# EAGLE design XmasTree (EAGLE 9.6.2)
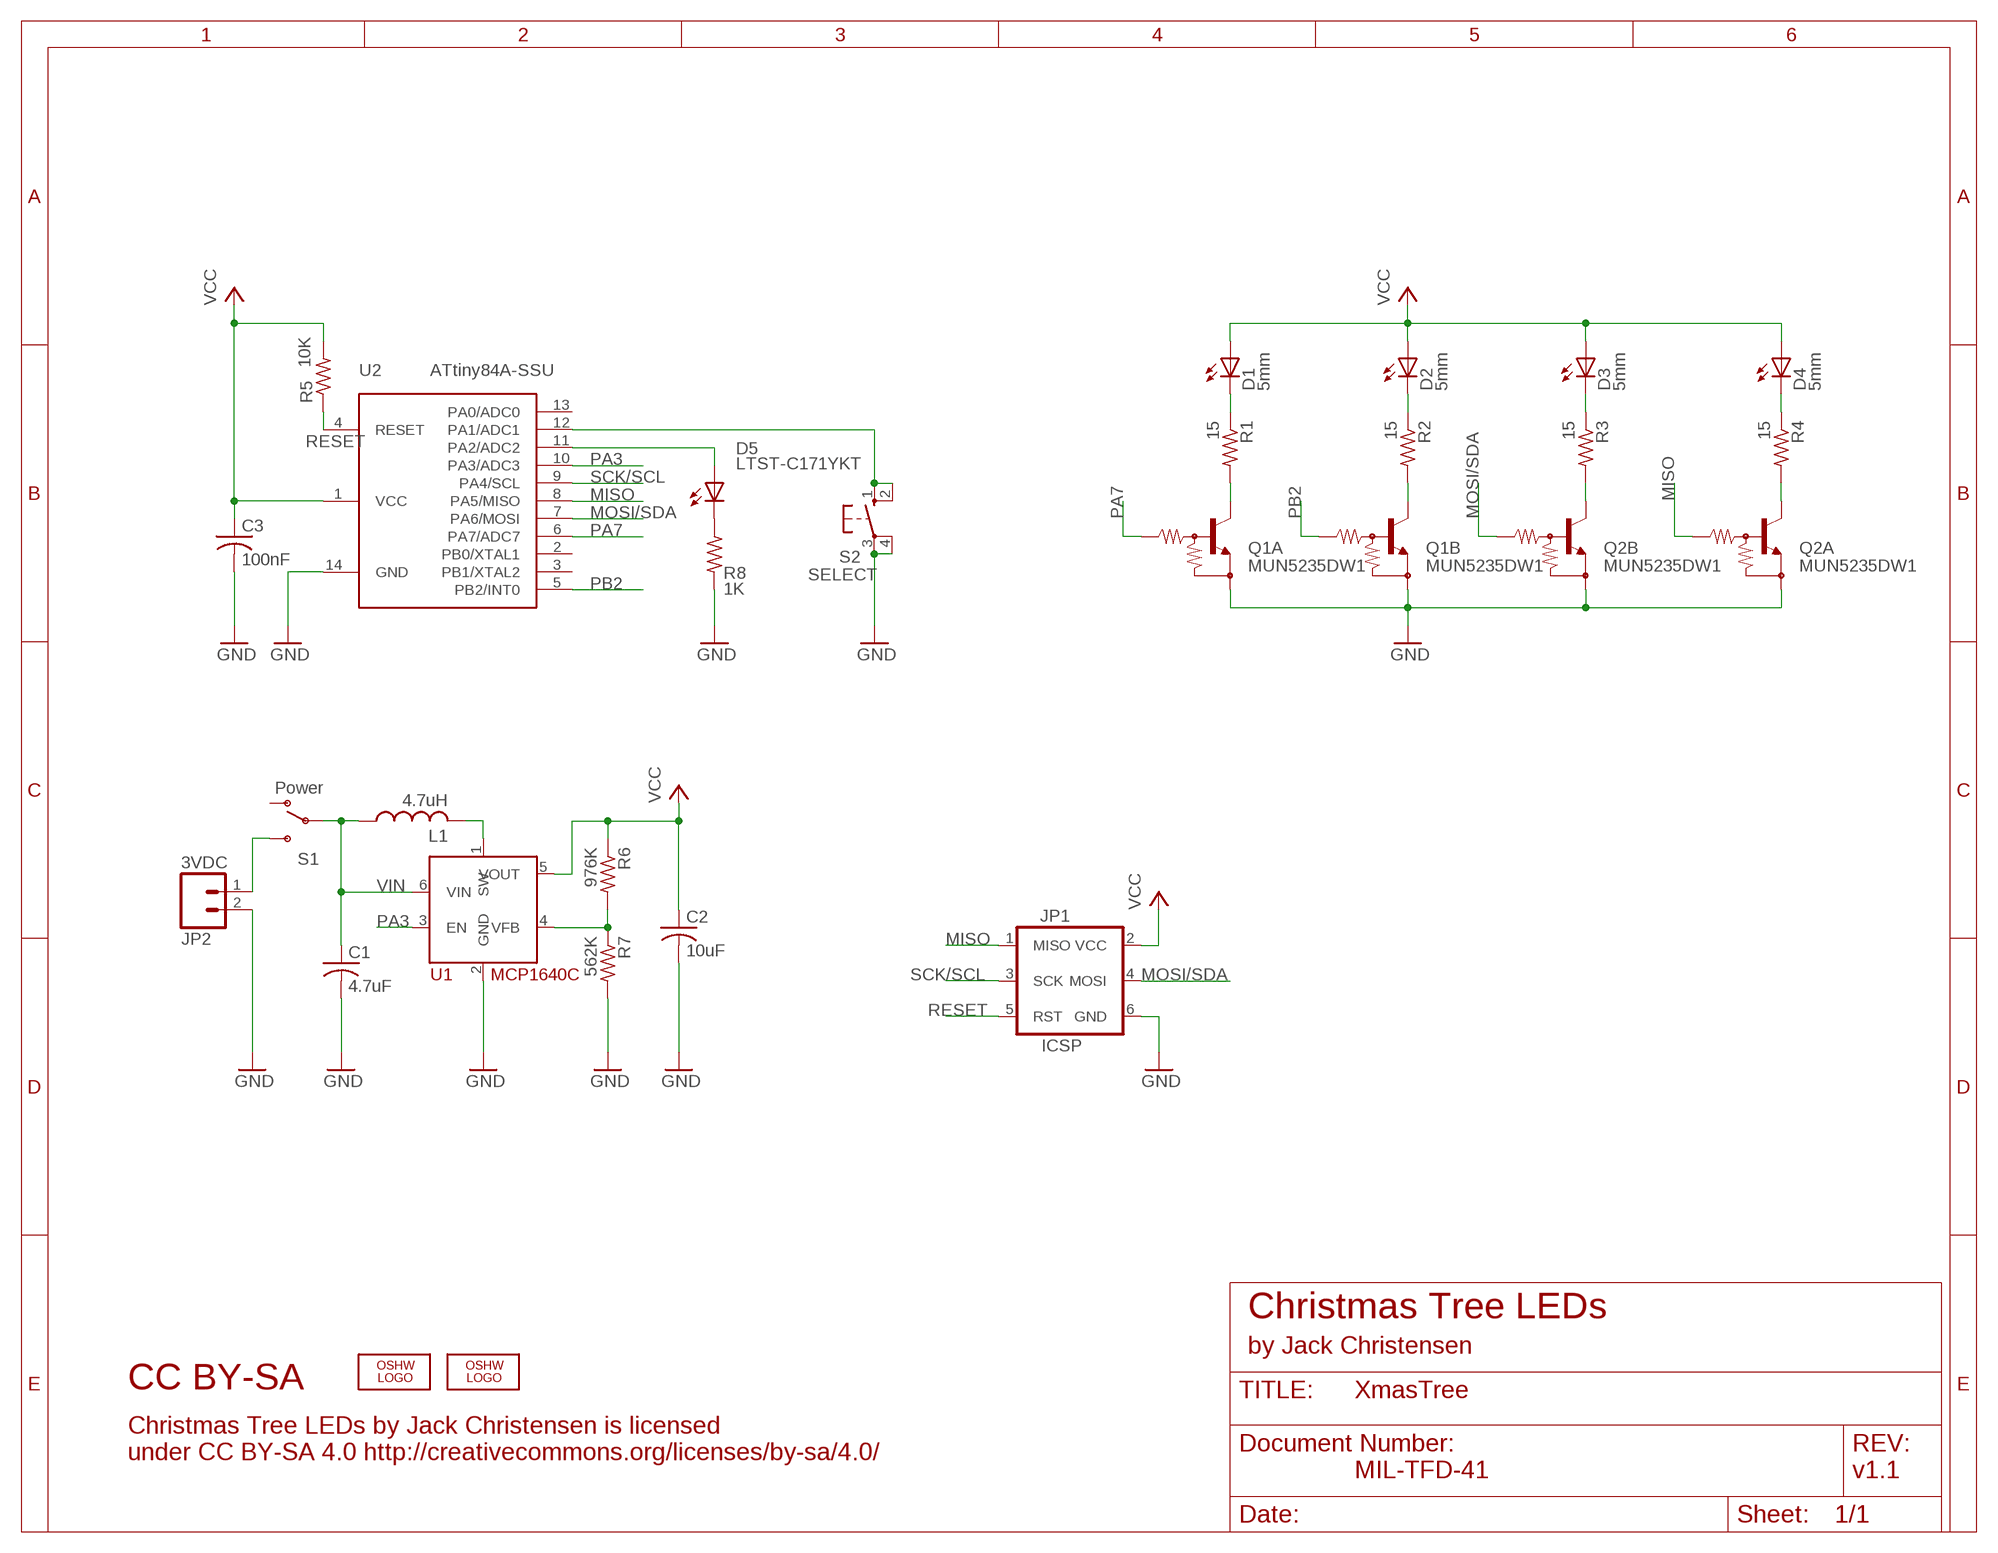
[diagram p0: schematic, sheet 1]

## Parts
C1  4.7uF  C-USM0805  [M0805]
C2  10uF  C-USM0805  [M0805]
C3  100nF  C-USM0805  [M0805]
D1  5mm  LED5MM  [LED5MM]
D2  5mm  LED5MM  [LED5MM]
D3  5mm  LED5MM  [LED5MM]
D4  5mm  LED5MM  [LED5MM]
D5  LTST-C171YKT  LEDD0805  [D0805]
JP1  ICSP  AVR_SPI_PRG_62X3_LOCK  [2X3_LOCK]
JP2  3VDC  M02  [1X02_LONGPADS]
L1  4.7uH  INDUCTORC1210K  [C1210K]
LOGO1  OSHW_LOGO_8MILX0150-NT  [OSHW_8X150_NOTEXT]
LOGO2  OSHW_LOGO_8MILX0150-NT  [OSHW_8X150_NOTEXT]
Q1  MUN5235DW1  MUN52XXSOT363  [SOT363_PHILIPS]
Q2  MUN5235DW1  MUN52XXSOT363  [SOT363_PHILIPS]
R1  15  R-US_M0805  [M0805]
R2  15  R-US_M0805  [M0805]
R3  15  R-US_M0805  [M0805]
R4  15  R-US_M0805  [M0805]
R5  10K  R-US_M0805  [M0805]
R6  976K  R-US_M0805  [M0805]
R7  562K  R-US_M0805  [M0805]
R8  1K  R-US_M0805  [M0805]
S1  Power  SWITCH-SPST  [JS102011CQN]
S2  SELECT  10-XXOCT  [B3F-10XXOCT]
U1  MCP1640C  MCP1640  [SOT23-6]
U2  ATtiny84A-SSU  ATTINYX4SO14  [SO14]

## Nets
GND: C1.2 C2.2 C3.2 JP1.6(GND) JP2.2 Q1.1(B:E) Q1.4(A:E) Q2.1(B:E) Q2.4(A:E) R7.2 R8.2 S2.3(P) S2.4(P1) U1.2(GND) U2.14(GND)
MISO: JP1.1(MISO) Q2.5(A:B) U2.8(PA5/MISO)
MOSI/SDA: JP1.4(MOSI) Q2.2(B:B) U2.7(PA6/MOSI)
N$1: D1.K(C) R1.1
N$2: R6.2 R7.1 U1.4(VFB)
N$3: D2.K(C) R2.1
N$4: Q2.6(B:C) R3.2
N$5: Q1.3(A:C) R1.2
N$6: JP2.1 S1.P$3(S)
N$7: L1.2 U1.1(SW)
N$8: Q1.6(B:C) R2.2
N$9: Q2.3(A:C) R4.2
N$10: D5.K(C) R8.1
N$11: D5.A U2.11(PA2/ADC2)
N$12: S2.1(S) S2.2(S1) U2.12(PA1/ADC1)
N$14: D4.K(C) R4.1
N$15: D3.K(C) R3.1
PA3: U1.3(EN) U2.10(PA3/ADC3)
PA7: Q1.5(A:B) U2.6(PA7/ADC7)
PB2: Q1.2(B:B) U2.5(PB2/INT0)
RESET: JP1.5(RST) R5.1 U2.4(RESET)
SCK/SCL: JP1.3(SCK) U2.9(PA4/SCL)
VCC: C2.1 C3.1 D1.A D2.A D3.A D4.A JP1.2(VCC) R5.2 R6.1 U1.5(VOUT) U2.1(VCC)
VIN: C1.1 L1.1 S1.P$2(P) U1.6(VIN)
Unconnected: S1.P$1(O) U2.2(PB0/XTAL1) U2.3(PB1/XTAL2) U2.13(PA0/ADC0)

## Notes on the sheet
- Christmas Tree LEDs
- by Jack Christensen
- CC BY-SA
- Christmas Tree LEDs by Jack Christensen is licensed
  under CC BY-SA 4.0 http://creativecommons.org/licenses/by-sa/4.0/
- MIL-TFD-41 | v1.1

## Library data of the parts
C1-C3 = _jc:C-US: CAPACITOR, American symbol
D1-D5 = _jc:LED: LED OSRAM: - CHIPLED LG R971, LG N971, LY N971, LG Q971, LY Q971, LO R971, LY R971 LH N974, LH R974 LS Q976, LO Q976, LY Q976 LO Q996 - Hyper CHIPLED LW Q18S LB Q993, LB Q99A, LB R99A - SideLED LS A670, LO A670, LY A670, LG A670, LP A670 LB A673, LV A673, LT A673, LW A673 LH A674 LY A675 LS A676, LA A676, LO A676, LY A676, LW A676 LS A679, LY A679, LG A679 - Hyper Micro SIDELED® LS Y876, LA Y876, LO Y876, LY Y876 LT Y87S - SmartLED LW L88C, LW L88S LB L89C, LB L89S, LG L890 LS L89K, LO L89K, LY L89K LS L896, LA L896, LO L896, LY L896 - TOPLED LS T670, LO T670, LY T670, LG T670, LP T670 LSG T670, LSP T670, LSY T670, LOP T670, LYG T670 LG T671, LOG T671, LSG T671 LB T673, LV T673, LT T673, LW T673 LH T674 LS T676, LA T676, LO T676, LY T676, LB T676, LH T676, LSB T676, LW T676 LB T67C, LV T67C, LT T67C, LS T67K, LO T67K, LY T67K, LW E67C LS E67B, LA E67B, LO E67B, LY E67B, LB E67C, LV E67C, LT E67C LW T67C LS T679, LY T679, LG T679 LS T770, LO T770, LY T770, LG T770, LP T770 LB T773, LV T773, LT T773, LW T773 LH T774 LS E675, LA E675, LY E675, LS T675 LS T776, LA T776, LO T776, LY T776, LB T776 LHGB T686 LT T68C, LB T68C - Hyper Mini TOPLED® LB M676 - Mini TOPLED Santana® LG M470 LS M47K, LO M47K, LY M47K Source: http://www.osram.convergy.de/
JP1 = _jc:AVR_SPI_PRG_6: AVR ISP 6 Pin This is the reduced ISP connector for AVR programming. Common on Arduino. This footprint will take up less PCB space and can be used with a 10-pin to 6-pin adapter such as SKU: BOB-08508
JP2 = SparkFun:M02: Header 2 Standard 2-pin 0.1" header. Use with straight break away headers (SKU : PRT-00116), right angle break away headers (PRT-00553), swiss pins (PRT-00743), machine pins (PRT-00117), and female headers (PRT-00115). Molex polarized connector foot print use with SKU : PRT-08233 with associated crimp pins and housings.
L1 = _jc:INDUCTOR: Murata #11R472C
LOGO1 LOGO2 = ohw-logo:OSHW_LOGO_8MIL
Q1 Q2 = _jc:MUN52XX
R1-R8 = _jc:R-US_: RESISTOR, American symbol
S1 = SparkFun:SWITCH-SPST: SPST Switch Simple slide switch. Spark Fun Electronics SKU : COM-00102
S2 = _jc:10-XX: OMRON SWITCH
U1 = _jc:MCP1640
U2 = _jc:ATTINYX4

## Board
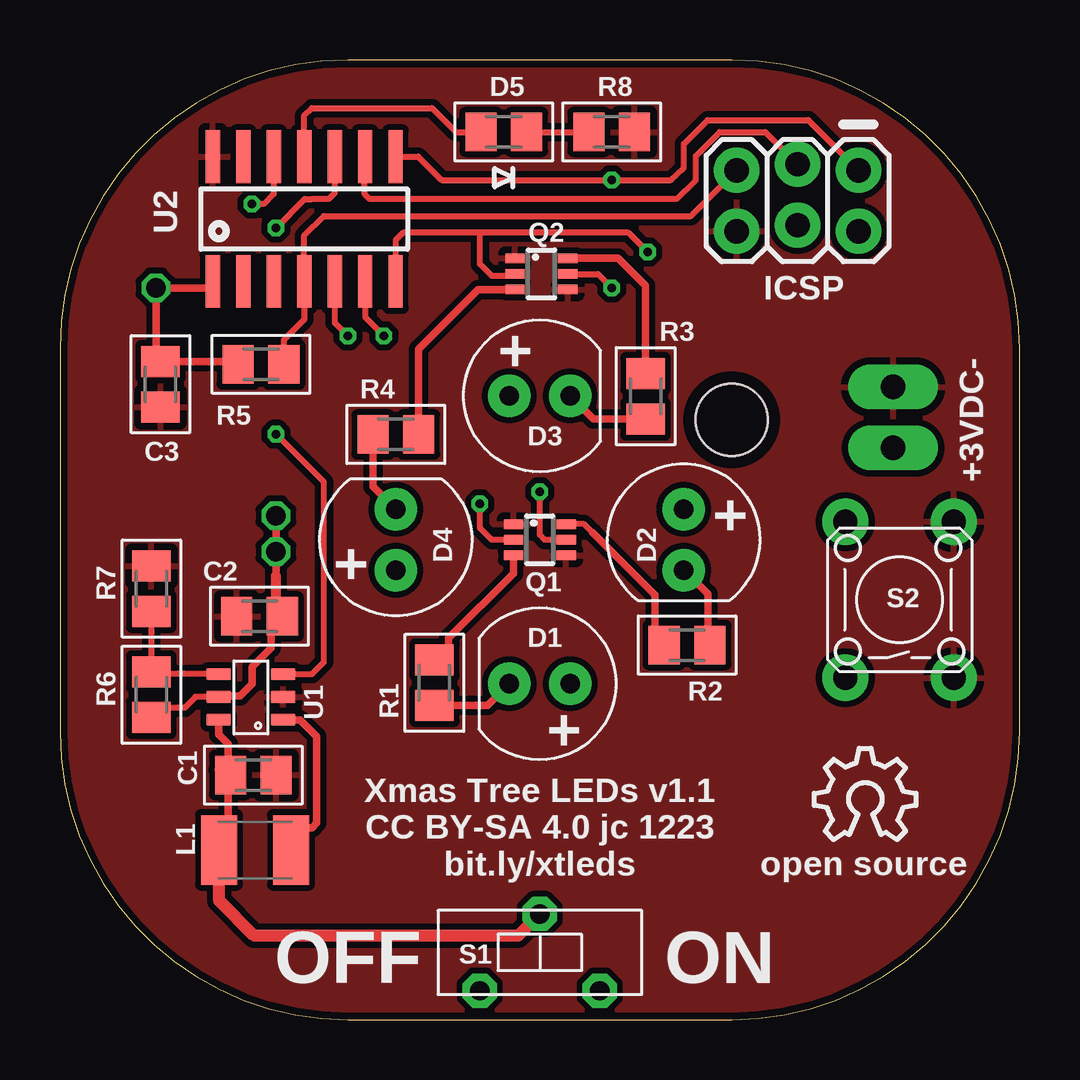
[diagram p1: board, top side]
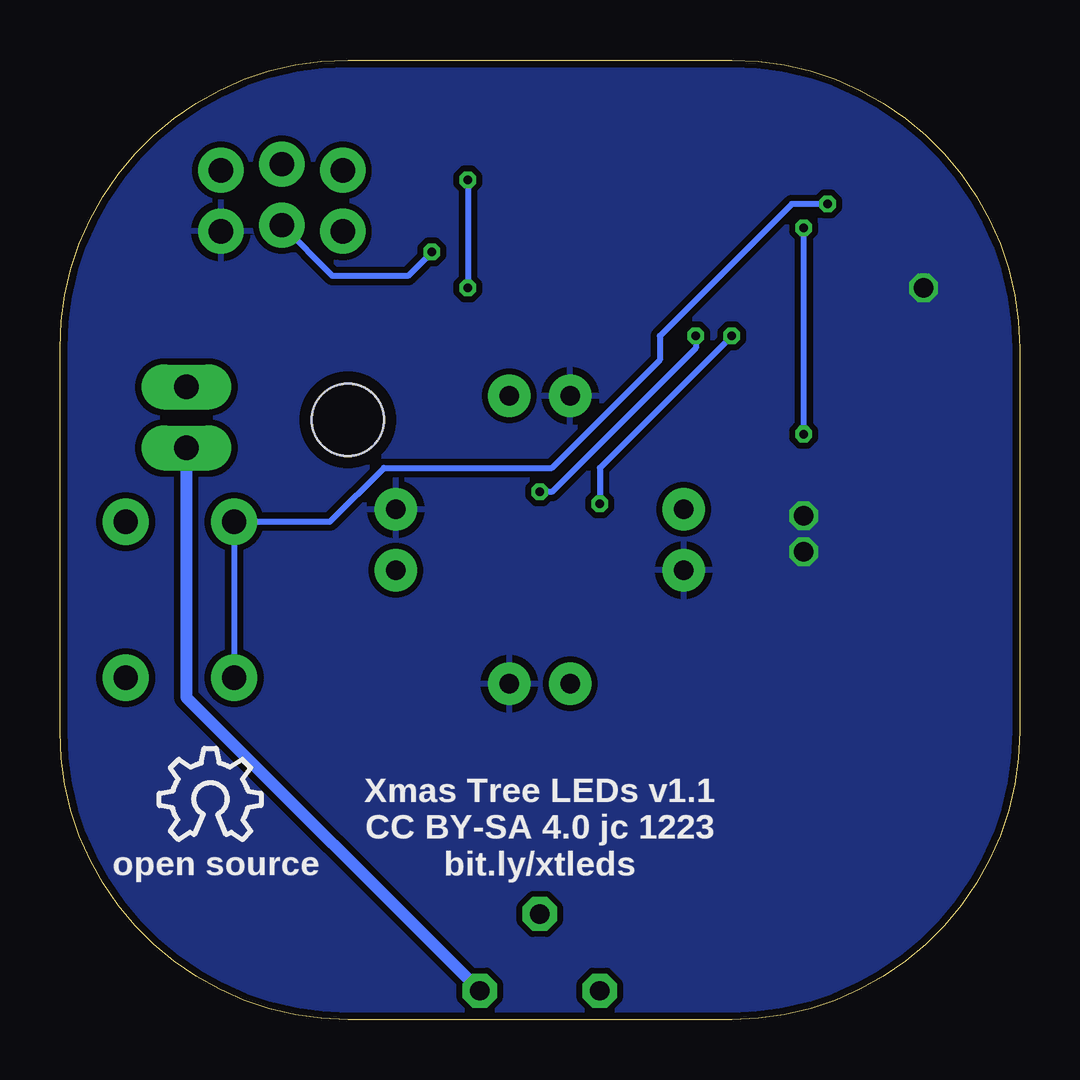
[diagram p2: board, bottom side, seen from below]

Size 40 x 40 mm. Coordinates in mm from the lower left corner, seen from the top.
Outline: 0,28 0,12 arc90 12,0 28,0 arc90 40,12 40,28 arc90 28,40 12,40 arc90 0,28
Copper layers (1*16): Top 0.0356mm / dielectric 1.5011mm / Bottom 0.0356mm
Design rules "oshpark-2layer-jc": minimum track width 8mil, minimum drill 13mil, track to track 8mil, track to pad 8mil, pad to pad 8mil, via to via 8mil, smd to smd 6mil, copper to edge 12mil, drill to drill 6mil, minimum pad ring 7mil, minimum via ring 7mil, stop-mask expansion 2.5mil, vias tented up to drill 20mil, thermal gap 12mil
Holes 3 mm at 28,25
tRestrict: area 26.2,23.2 to 29.8,26.8
bRestrict: area 26.2,23.2 to 29.8,26.8

### Footprints (pad centres in the part's own frame; a part is rotated, then mirrored left to right if it is on the bottom)
M0805 = smd 1.3 x 1.6: 1 -0.95,0; 2 0.95,0
LED5MM = drill 0.813 pad 1.778: A -1.27,0; K 1.27,0
D0805 = smd 1.3 x 1.6: A -0.95,0; K 0.95,0
2X3_LOCK = drill 1.016 pad 1.88: 1 0,0; 2 0,2.54; 3 2.54,-0.254; 4 2.54,2.286; 5 5.08,0; 6 5.08,2.54
1X02_LONGPADS = drill 1.016 pad 1.88 long: 1 0,0; 2 2.54,0
C1210K = smd 1.5 x 2.9: 1 -1.5,0; 2 1.5,0
SOT363_PHILIPS = smd 0.4 x 0.8: 1 -0.65,-1.1; 2 0,-1.1; 3 0.65,-1.1; 4 0.65,1.1; 5 0,1.1; 6 -0.65,1.1
JS102011CQN = drill 0.8 pad 1.422 octagon: P$1 -2.5,-1.6; P$2 0,1.6; P$3 2.5,-1.6
B3F-10XXOCT = drill 1.016 pad 1.93: 1 -3.251,2.261; 2 3.251,2.261; 3 -3.251,-2.261; 4 3.251,-2.261
SOT23-6 = smd 0.508 x 1.016: 1 -0.95,-1.35; 2 0,-1.35; 3 0.95,-1.35; 4 0.95,1.35; 5 0,1.35; 6 -0.95,1.35
SO14 = smd 0.6 x 2.2: 1 -3.81,-2.6; 2 -2.54,-2.6; 3 -1.27,-2.6; 4 0,-2.6; 5 1.27,-2.6; 6 2.54,-2.6; 7 3.81,-2.6; 8 3.81,2.6; 9 2.54,2.6; 10 1.27,2.6; 11 0,2.6; 12 -1.27,2.6; 13 -2.54,2.6; 14 -3.81,2.6

### Placement (x,y rotation side)
C1  8.06,10.19 0 top
C2  8.32,16.81 180 top
C3  4.19,26.48 270 top
D1  20,14 180 top
D2  26,20 270 top
D3  20,26 0 top
D4  14,20 90 top
D5  18.5,37 0 top
JP1  33.29,35.4 180 top
JP2  34.73,23.83 90 top
L1  8.13,7.07 0 top
LOGO1  31.44,7.5 0 top
LOGO2  35.86,7.5 0 bottom
Q1  20,20 270 top
Q2  20.07,31.08 270 top
R1  15.61,14.04 90 top
R2  26.14,15.61 180 top
R3  24.41,25.98 90 top
R4  14,24.39 0 top
R5  8.38,27.31 180 top
R6  3.81,13.54 90 top
R7  3.81,17.96 90 top
R8  23,37 0 top
S1  20,2.8 0 top
S2  35,17.5 90 top
U1  7.96,13.45 90 top
U2  10.18,33.37 0 top

### Tracks (layer width: path | path; a pad name or v marks a point on that pad's centre or on a via)
GND
  pour Top (isolate 0.254): -1.5,-1.5 41.5,-1.5 41.5,41.5 -1.5,41.5
MISO  (via drill 0.35)
  Top 0.254: U2.8 14.93,35.97 15.9,35 v23,35 25.47,35 26,35.5 26,36.5 27,37.5 31.19,37.5 JP1.1 | v23,30.5 22.42,31.08 Q2.5
  Bottom 0.254: v23,35 v23,30.5
MOSI/SDA  (via drill 0.35)
  Top 0.254: v24.5,32 23.7,32.8 17.5,32.8 | U2.7 13.99,32.49 14.3,32.8 17.5,32.8 | Q2.2 18.89,31 18,31 17.5,31.5 17.5,32.8
  Bottom 0.254: v24.5,32 25.5,31 28.64,31 JP1.4
N$1
  Top 0.305: D1.K 17.82,13.09 R1.1
N$2
  Top 0.254: R7.1 R6.2 3.9,14.4 U1.4
N$3
  Top 0.305: R2.1 27,15.7 27,17.73 D2.K
N$4
  Top 0.305: Q2.6 23.27,31.73 24.41,30.59 R3.2
N$5
  Top 0.305: Q1.3 18.9,18.6 16.2,15.9 16.2,15.3 15.89,14.99 R1.2
N$6
  Bottom 0.508: JP2.1 34.73,13.43 S1.P$3
N$7
  Top 0.305: U1.1 10,12.5 10.7,11.8 10.7,8.2 10.5,8 10,8 10,7.44 L1.2
N$8
  Top 0.254: 22.2,20.3 21.85,20.65 Q1.6
  Top 0.305: 22.2,20.3 24.8,17.7 24.8,16 R2.2
N$9
  Top 0.305: Q2.3 17.43,30.43 14.95,27.95 R4.2
N$10
  Top 0.254: D5.K R8.1
N$11
  Top 0.254: U2.11 10.18,37.68 10.5,38 15.5,38 16.5,37 D5.A
N$12  (via drill 0.35)
  Top 0.254: U2.12 8.91,34.41 8.5,34 v8,34
  Bottom 0.254: v8,34 9.5,34 15,28.5 15,27.5 19.5,23 26.5,23 28.75,20.75 S2.2 S2.1
N$14
  Top 0.305: D4.K 13.05,22.22 R4.1
N$15
  Top 0.305: D3.K 22.24,25.03 R3.1
PA3  (via drill 0.35)
  Top 0.254: U2.10 11.45,34.45 11.2,34.2 10.5,34.2 10.2,34.2 v9,33 | v9,24.4 11,22.4 11,14.9 10.5,14.4 U1.3
  Bottom 0.254: v9,24.4 v9,33
PA7  (via drill 0.35)
  Top 0.254: Q1.5 20.2,20 20,20.2 v20,22 | U2.6 12.72,29.28 v13.5,28.5
  Bottom 0.254: v20,22 19.5,22 13.5,28 v13.5,28.5
PB2  (via drill 0.35)
  Top 0.254: U2.5 11.45,29.05 v12,28.5 | Q1.2 18,20 17.5,20.5 v17.5,21.5
  Bottom 0.254: v12,28.5 17.5,23 v17.5,21.5
RESET
  Top 0.254: R5.1 9.33,28.33 10.18,29.18 U2.4 10.18,32.68 11,33.5 26.31,33.5 JP1.5
SCK/SCL
  Top 0.254: JP1.3 29.4,37 27.5,37 26.5,36 26.5,35 25.7,34.2 12.9,34.2 12.7,34.4 12.7,35.95 U2.9
VCC  (via drill 0.8)
  Top 0.254: U1.5 5.65,13.45 5.2,13 4,13 3.81,12.81 R6.1
  Top 0.305: U2.1 6.1,30.5 v4,30.5 4,27.62 C3.1 7.31,27.43 R5.2 | U1.5 6.66,13.5 7.5,13.5 8,14 8,14.7 8.8,15.5 8.8,16.1 9.27,16.57 C2.1 | 9,18.5 v9,19.5 v9,21
  Top 0.406: C2.1 9,17.08 9,18.5
  pour Bottom (isolate 0.254): -1,-1 41,-1 41,41 -1,41
VIN
  Top 0.305: U1.6 6.61,11.89 7,11.5 7,10.8 6.6,10.4 6.81,10.19 C1.1 7,10.08 7,7.44 L1.1
  Top 0.508: L1.1 6.63,4.97 8.1,3.5 19.1,3.5 S1.P$2

### Text on the board
tPlace: ICSP | +3VDC- | Xmas Tree LEDs v1.1 / CC BY-SA 4.0 jc 1223 / bit.ly/xtleds | open source | OFF | ON
bPlace: Xmas Tree LEDs v1.1 / CC BY-SA 4.0 jc 1223 / bit.ly/xtleds | open source